# EAGLE schematic facebook-squared-schematic (EAGLE 6.2)
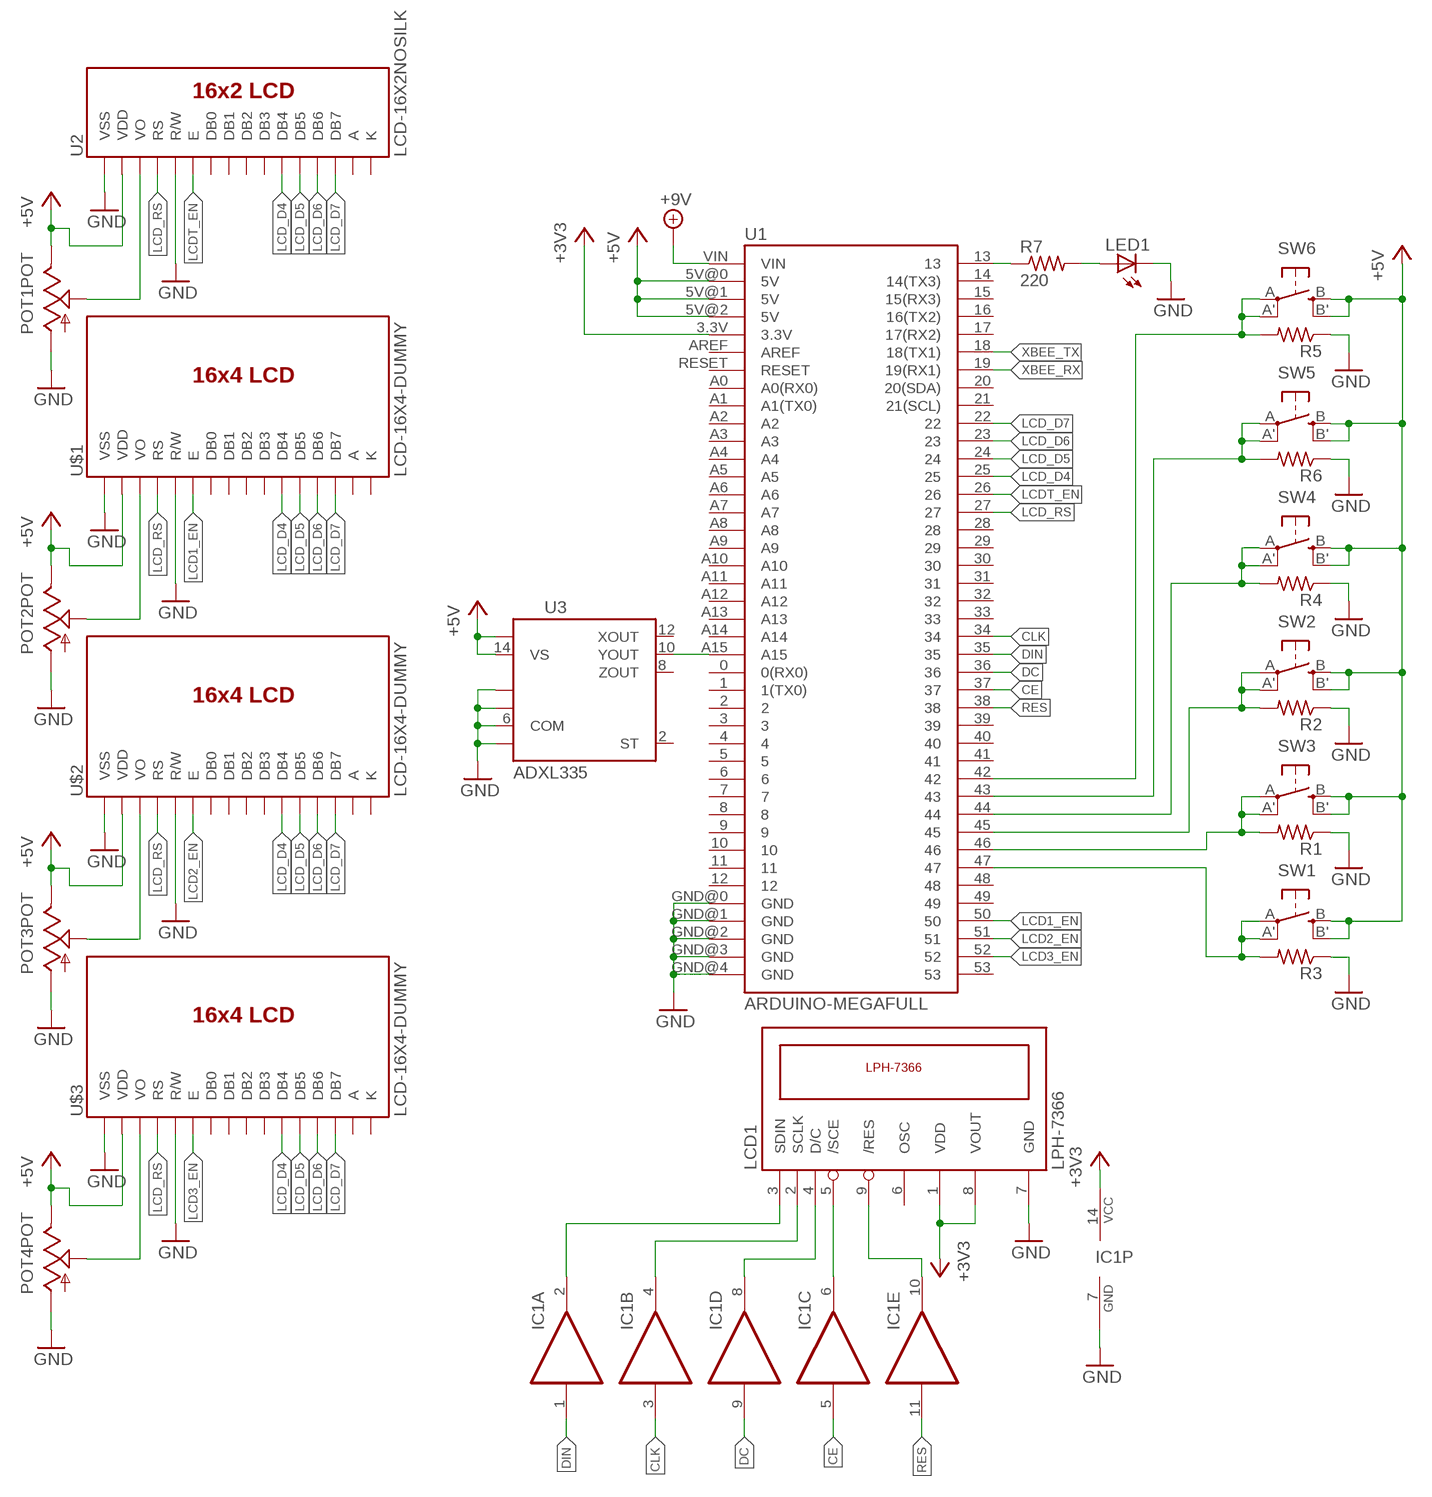
[diagram p0: schematic, sheet 1]

## Parts
IC1  74LS07N  [DIL14]
LCD1  LPH-7366  [LPH-7366]
LED1  LED5MM  [LED5MM]
POT1  THUMBPOTV  [THUMBWHEELV]
POT2  THUMBPOTV  [THUMBWHEELV]
POT3  THUMBPOTV  [THUMBWHEELV]
POT4  THUMBPOTV  [THUMBWHEELV]
R1  R-US_0309/12  [0309/12]
R2  R-US_0309/12  [0309/12]
R3  R-US_0309/12  [0309/12]
R4  R-US_0309/12  [0309/12]
R5  R-US_0309/12  [0309/12]
R6  R-US_0309/12  [0309/12]
R7  220  R-US_0309/12  [0309/12]
SW1  SPST_TACT-EVQQ2  [EVQ-Q2]
SW2  SPST_TACT-EVQQ2  [EVQ-Q2]
SW3  SPST_TACT-EVQQ2  [EVQ-Q2]
SW4  SPST_TACT-EVQQ2  [EVQ-Q2]
SW5  SPST_TACT-EVQQ2  [EVQ-Q2]
SW6  SPST_TACT-EVQQ2  [EVQ-Q2]
U1  ARDUINO-MEGAFULL  [ARDUINO_MEGA]
U2  LCD-16X2NOSILK  [LCD-16X2_NOSILK]
U3  ADXL335  [LFCSP-16]
U$1  LCD-16X4-DUMMY  [LCD-16X2_NOSILK]
U$2  LCD-16X4-DUMMY  [LCD-16X2_NOSILK]
U$3  LCD-16X4-DUMMY  [LCD-16X2_NOSILK]

## Nets
+3V3: IC1.14(P:VCC) LCD1.1(VDD) LCD1.8(VOUT) U1.3.3V
+5V: POT1.E(POT:E) POT2.E(POT:E) POT3.E(POT:E) POT4.E(POT:E) SW1.B'(S1) SW1.B(S) SW2.B'(S1) SW2.B(S) SW3.B'(S1) SW3.B(S) SW4.B'(S1) SW4.B(S) SW5.B'(S1) SW5.B(S) SW6.B'(S1) SW6.B(S) U1.5V@0(5V) U1.5V@1(5V) U1.5V@2(5V) U2.2(VDD) U3.14(VS) U3.15(VS) U$1.2(VDD) U$2.2(VDD) U$3.2(VDD)
+9V: U1.VIN
CE: IC1.5(C:I) U1.37
CLK: IC1.3(B:I) U1.34
DC: IC1.9(D:I) U1.36
DIN: IC1.1(A:I) U1.35
GND: IC1.7(P:GND) LCD1.7(GND) LED1.K(C) POT1.A(POT:A) POT2.A(POT:A) POT3.A(POT:A) POT4.A(POT:A) R1.1 R2.1 R3.1 R4.1 R5.1 R6.1 U1.GND@0(GND) U1.GND@1(GND) U1.GND@2(GND) U1.GND@3(GND) U1.GND@4(GND) U2.1(VSS) U2.5(R/W) U3.3(COM) U3.5(COM) U3.6(COM) U3.7(COM) U$1.1(VSS) U$1.5(R/W) U$2.1(VSS) U$2.5(R/W) U$3.1(VSS) U$3.5(R/W)
LCD1_EN: U1.50 U$1.6(E)
LCD2_EN: U1.51 U$2.6(E)
LCD3_EN: U1.52 U$3.6(E)
LCD_D4: U1.25 U2.11(DB4) U$1.11(DB4) U$2.11(DB4) U$3.11(DB4)
LCD_D5: U1.24 U2.12(DB5) U$1.12(DB5) U$2.12(DB5) U$3.12(DB5)
LCD_D6: U1.23 U2.13(DB6) U$1.13(DB6) U$2.13(DB6) U$3.13(DB6)
LCD_D7: U1.22 U2.14(DB7) U$1.14(DB7) U$2.14(DB7) U$3.14(DB7)
LCD_RS: U1.27 U2.4(RS) U$1.4(RS) U$2.4(RS) U$3.4(RS)
LCDT_EN: U1.26 U2.6(E)
N$1: POT1.S(POT:S) U2.3(VO)
N$2: POT2.S(POT:S) U$1.3(VO)
N$3: POT3.S(POT:S) U$2.3(VO)
N$4: POT4.S(POT:S) U$3.3(VO)
N$5: U1.A15 U3.10(YOUT)
N$6: R7.1 U1.13
N$7: LED1.A R7.2
N$8: R4.2 SW4.A'(P1) SW4.A(P) U1.44
N$9: R6.2 SW5.A'(P1) SW5.A(P) U1.43
N$10: R5.2 SW6.A'(P1) SW6.A(P) U1.42
N$11: R3.2 SW1.A'(P1) SW1.A(P) U1.47
N$12: R1.2 SW3.A'(P1) SW3.A(P) U1.46
N$13: R2.2 SW2.A'(P1) SW2.A(P) U1.45
N$14: IC1.4(B:O) LCD1.2(SCLK)
N$15: IC1.2(A:O) LCD1.3(SDIN)
N$16: IC1.8(D:O) LCD1.4(D/C)
N$17: IC1.6(C:O) LCD1.5(/SCE)
N$18: IC1.10(E:O) LCD1.9(/RES)
RES: IC1.11(E:I) U1.38
XBEE_RX: U1.19(19(RX1))
XBEE_TX: U1.18(18(TX1))
Unconnected: IC1.12(F:O) IC1.13(F:I) LCD1.6(OSC) POT1.SW1(SW:S) POT1.SW2(SW:P) POT2.SW1(SW:S) POT2.SW2(SW:P) POT3.SW1(SW:S) POT3.SW2(SW:P) POT4.SW1(SW:S) POT4.SW2(SW:P) U1.0(0(RX0)) U1.1(1(TX0)) U1.2 U1.3 U1.4 U1.5 U1.6 U1.7 U1.8 U1.9 U1.10 U1.11 U1.12 U1.14(14(TX3)) U1.15(15(RX3)) U1.16(16(TX2)) U1.17(17(RX2)) U1.20(20(SDA)) U1.21(21(SCL)) U1.28 U1.29 U1.30 U1.31 U1.32 U1.33 U1.39 U1.40 U1.41 U1.48 U1.49 U1.53 U1.A0(A0(RX0)) U1.A1(A1(TX0)) U1.A2 U1.A3 U1.A4 U1.A5 U1.A6 U1.A7 U1.A8 U1.A9 U1.A10 U1.A11 U1.A12 U1.A13 U1.A14 U1.AREF U1.RESET U2.7(DB0) U2.8(DB1) U2.9(DB2) U2.10(DB3) U3.2(ST) U3.8(ZOUT) U3.12(XOUT) U$1.7(DB0) U$1.8(DB1) U$1.9(DB2) U$1.10(DB3) U$2.7(DB0) U$2.8(DB1) U$2.9(DB2) U$2.10(DB3) U$3.7(DB0) U$3.8(DB1) U$3.9(DB2) U$3.10(DB3)

## Power pins joined to a net without a drawn wire
A: U2.15(A) U$1.15(A) U$2.15(A) U$3.15(A)
K: U2.16(K) U$1.16(K) U$2.16(K) U$3.16(K)

## Library data of the parts
IC1 = 74xx-us:74*07: Hex BUFFER, open collector high-voltage output
LCD1 = lph-7366:LPH-7366
LED1 = adafruit:LED: LED OSRAM: - CHIPLED LG R971, LG N971, LY N971, LG Q971, LY Q971, LO R971, LY R971 LH N974, LH R974 LS Q976, LO Q976, LY Q976 LO Q996 - Hyper CHIPLED LW Q18S LB Q993, LB Q99A, LB R99A - SideLED LS A670, LO A670, LY A670, LG A670, LP A670 LB A673, LV A673, LT A673, LW A673 LH A674 LY A675 LS A676, LA A676, LO A676, LY A676, LW A676 LS A679, LY A679, LG A679 - Hyper Micro SIDELED® LS Y876, LA Y876, LO Y876, LY Y876 LT Y87S - SmartLED LW L88C, LW L88S LB L89C, LB L89S, LG L890 LS L89K, LO L89K, LY L89K LS L896, LA L896, LO L896, LY L896 - TOPLED LS T670, LO T670, LY T670, LG T670, LP T670 LSG T670, LSP T670, LSY T670, LOP T670, LYG T670 LG T671, LOG T671, LSG T671 LB T673, LV T673, LT T673, LW T673 LH T674 LS T676, LA T676, LO T676, LY T676, LB T676, LH T676, LSB T676, LW T676 LB T67C, LV T67C, LT T67C, LS T67K, LO T67K, LY T67K, LW E67C LS E67B, LA E67B, LO E67B, LY E67B, LB E67C, LV E67C, LT E67C LW T67C LS T679, LY T679, LG T679 LS T770, LO T770, LY T770, LG T770, LP T770 LB T773, LV T773, LT T773, LW T773 LH T774 LS E675, LA E675, LY E675, LS T675 LS T776, LA T776, LO T776, LY T776, LB T776 LHGB T686 LT T68C, LB T68C - Hyper Mini TOPLED® LB M676 - Mini TOPLED Santana® LG M470 LS M47K, LO M47K, LY M47K Source: http://www.osram.convergy.de/
POT1-POT4 = adafruit:THUMBPOT: Thumbwheel pot with switch Available in horizontal (Alpha RV121SF) or vertical (Xicon 311-1701)
R1-R7 = adafruit:R-US_: RESISTOR, American symbol
SW1-SW6 = adafruit:SPST_TACT: SMT 6mm switch, EVQQ2 series http://www.ladyada.net/library/eagle
U1 = SparkFun-Boards:ARDUINO-MEGA: Arduino Mega board footprint
U2 = SparkFun-Displays:LCD-16X2: Standard text-only 16x2 parallel input LCD
U3 = SparkFun-Sensors:ADXL335: 3-axis, 3g accelerometer, analog out
U$1-U$3 = SparkFun-Displays:LCD-16X4-DUMMY